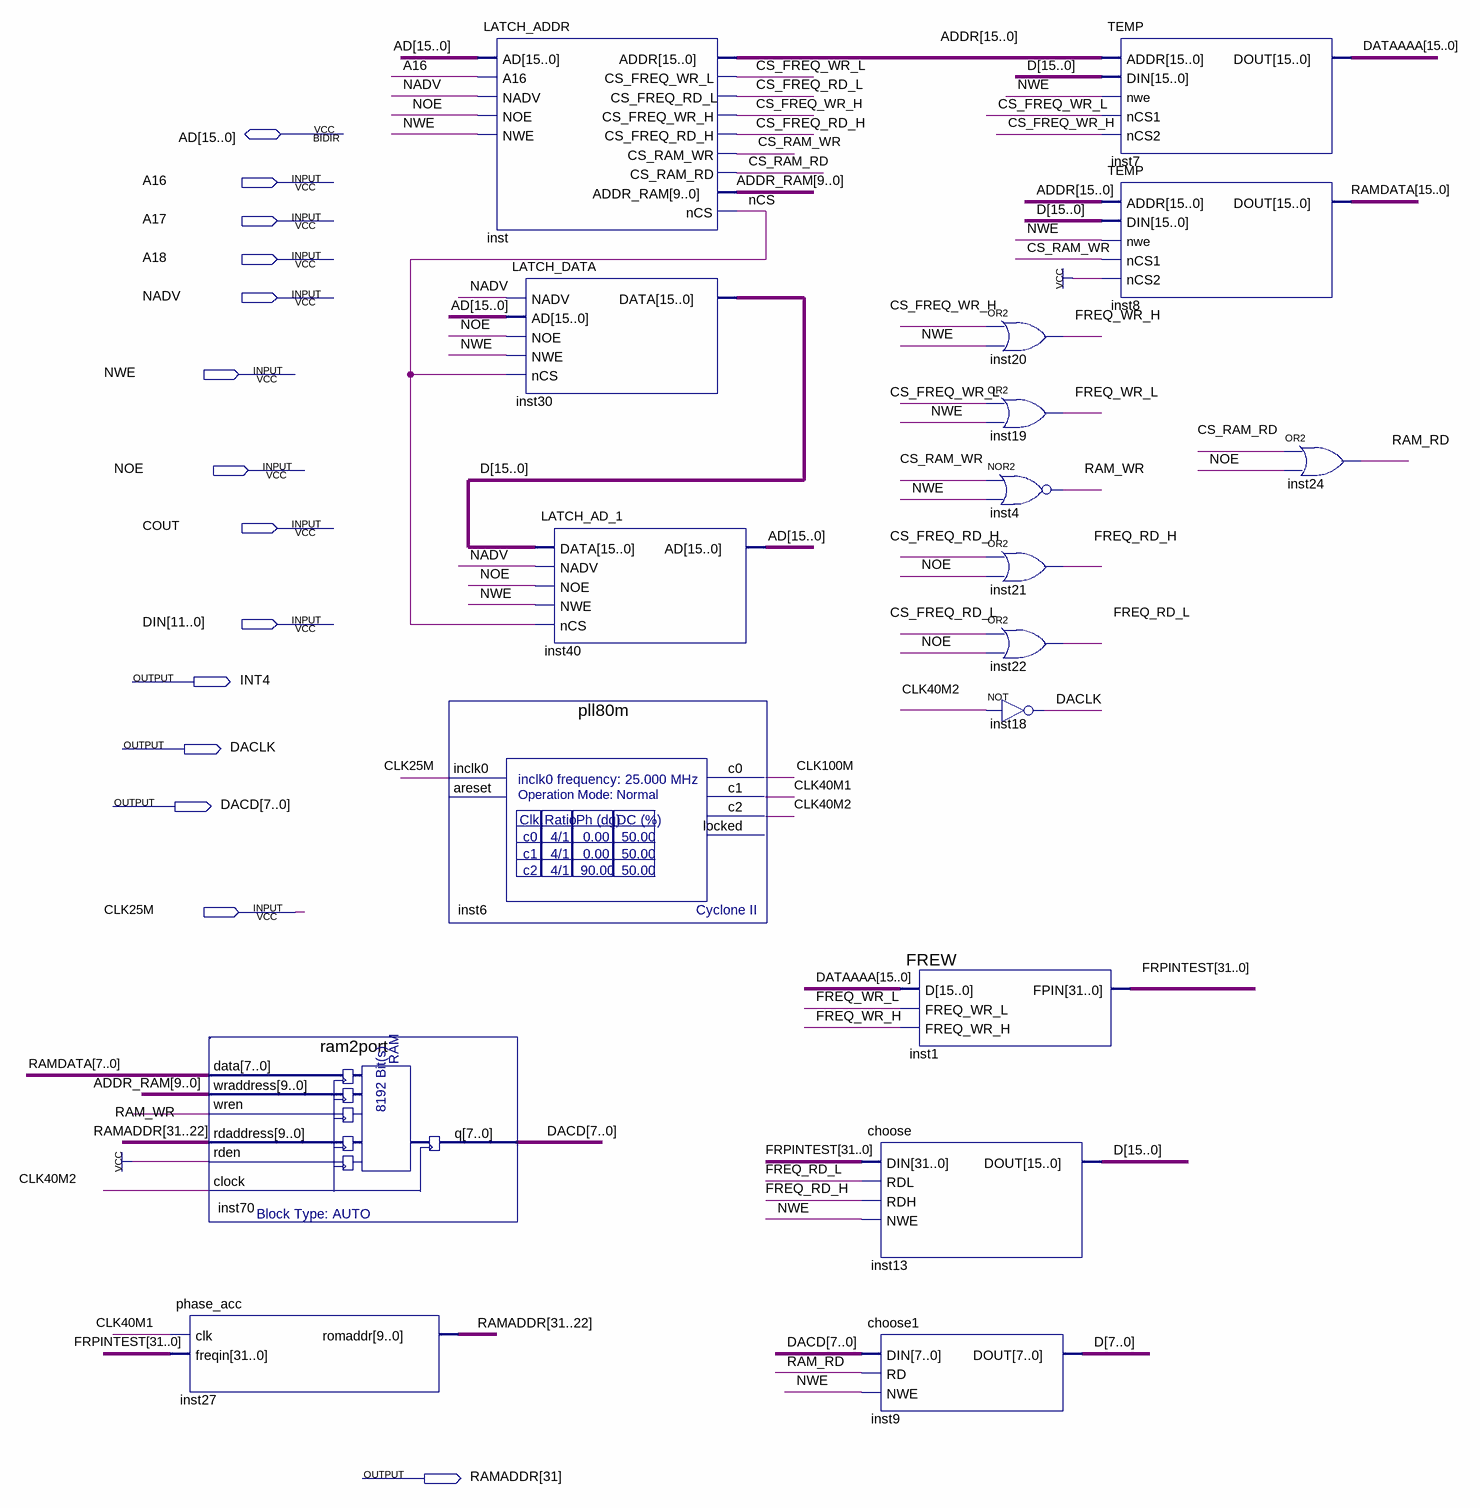
[diagram p0: schematic sheet]
// Quartus schematic FPGACONTROL.bdf as structural Verilog: 18 symbols, 14 pins
module FPGACONTROL (
  input  A16,
  input  A17,
  input  A18,
  input  NADV,
  input  NWE,
  input  NOE,
  input  COUT,
  input  [11:0] DIN,
  input  CLK25M,
  inout  [15:0] AD,
  output INT4,
  output DACLK,
  output [7:0] DACD,
  output [31:22] RAMADDR
);

  wire CLK40M1, CLK40M2, CLK100M, CS_FREQ_RD_H, CS_FREQ_RD_L, CS_FREQ_WR_H, CS_FREQ_WR_L, CS_RAM_RD,
       CS_RAM_WR, FREQ_RD_H, FREQ_RD_L, FREQ_WR_H, FREQ_WR_L, nCS, RAM_RD, RAM_WR;
  wire [9:0] ADDR_RAM;
  wire [15:0] ADDR, D, DATAAAA, RAMDATA;
  wire [31:0] FRPINTEST;

  ram2port inst70 (
    .data(RAMDATA[7:0]), .wraddress(ADDR_RAM), .wren(RAM_WR), .rdaddress(RAMADDR), .rden(1'b1),
    .clock(CLK40M2), .q(DACD));
  phase_acc inst27 (.clk(CLK40M1), .freqin(FRPINTEST), .romaddr(RAMADDR));
  pll80m inst6 (.inclk0(CLK25M), .c0(CLK100M), .c1(CLK40M1), .c2(CLK40M2));  // open: areset, locked
  LATCH_ADDR inst (
    .AD(AD), .A16(A16), .NADV(NADV), .NOE(NOE), .NWE(NWE), .ADDR(ADDR), .CS_FREQ_WR_L(CS_FREQ_WR_L),
    .CS_FREQ_RD_L(CS_FREQ_RD_L), .CS_FREQ_WR_H(CS_FREQ_WR_H), .CS_FREQ_RD_H(CS_FREQ_RD_H),
    .CS_RAM_WR(CS_RAM_WR), .CS_RAM_RD(CS_RAM_RD), .ADDR_RAM(ADDR_RAM), .nCS(nCS));
  LATCH_DATA inst30 (.NADV(NADV), .AD(AD), .NOE(NOE), .NWE(NWE), .nCS(nCS), .DATA(D));
  LATCH_AD_1 inst40 (.DATA(D), .NADV(NADV), .NOE(NOE), .NWE(NWE), .nCS(nCS), .AD(AD));
  FREW inst1 (.D(DATAAAA), .FREQ_WR_L(FREQ_WR_L), .FREQ_WR_H(FREQ_WR_H), .FPIN(FRPINTEST));
  choose inst13 (.DIN(FRPINTEST), .RDL(FREQ_RD_L), .RDH(FREQ_RD_H), .NWE(NWE), .DOUT(D));
  choose1 inst9 (.DIN(DACD), .RD(RAM_RD), .NWE(NWE), .DOUT(D[7:0]));
  or inst20 (FREQ_WR_H, CS_FREQ_WR_H, NWE);
  or inst19 (FREQ_WR_L, CS_FREQ_WR_L, NWE);
  nor inst4 (RAM_WR, CS_RAM_WR, NWE);
  or inst21 (FREQ_RD_H, CS_FREQ_RD_H, NOE);
  or inst22 (FREQ_RD_L, CS_FREQ_RD_L, NOE);
  not inst18 (DACLK, CLK40M2);
  TEMP inst7 (.ADDR(ADDR), .DIN(D), .nwe(NWE), .nCS1(CS_FREQ_WR_L), .nCS2(CS_FREQ_WR_H), .DOUT(DATAAAA));
  TEMP inst8 (.ADDR(ADDR), .DIN(D), .nwe(NWE), .nCS1(CS_RAM_WR), .nCS2(1'b1), .DOUT(RAMDATA));
  or inst24 (RAM_RD, CS_RAM_RD, NOE);
endmodule
